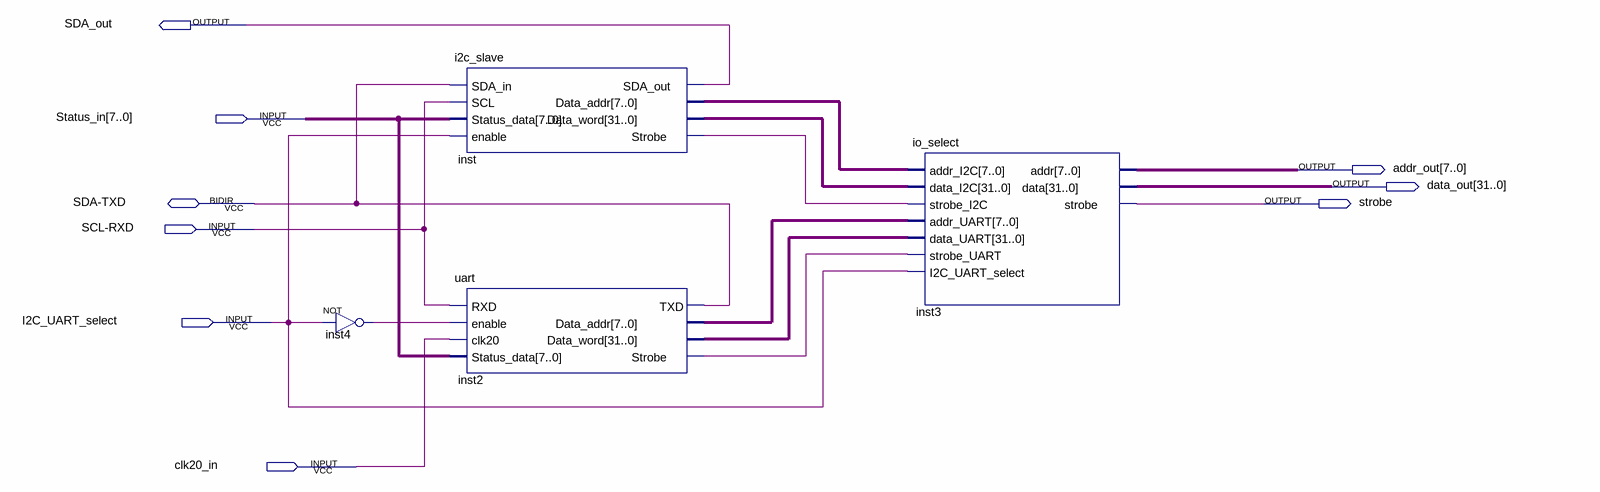
[diagram p0: schematic sheet]
// Quartus schematic control_interface.bdf as structural Verilog: 4 symbols, 9 pins
module control_interface (
  input  [7:0] Status_in,
  input  \SCL-RXD ,
  input  I2C_UART_select,
  input  clk20_in,
  inout  \SDA-TXD ,
  output SDA_out,
  output [7:0] addr_out,
  output [31:0] data_out,
  output strobe
);

  wire inst2_strobe, inst4_out, inst_strobe;
  wire [7:0] inst2_data_addr, inst_data_addr;
  wire [31:0] inst2_data_word, inst_data_word;

  not inst4 (inst4_out, I2C_UART_select);
  i2c_slave inst (
    .SDA_in(\SDA-TXD ), .SCL(\SCL-RXD ), .Status_data(Status_in), .enable(I2C_UART_select),
    .SDA_out(SDA_out), .Data_addr(inst_data_addr), .Data_word(inst_data_word), .Strobe(inst_strobe));
  uart inst2 (
    .RXD(\SCL-RXD ), .enable(inst4_out), .clk20(clk20_in), .Status_data(Status_in),
    .Data_addr(inst2_data_addr), .Data_word(inst2_data_word), .Strobe(inst2_strobe), .TXD(\SDA-TXD ));
  io_select inst3 (
    .addr_I2C(inst_data_addr), .data_I2C(inst_data_word), .strobe_I2C(inst_strobe),
    .addr_UART(inst2_data_addr), .data_UART(inst2_data_word), .strobe_UART(inst2_strobe),
    .I2C_UART_select(I2C_UART_select), .addr(addr_out), .data(data_out), .strobe(strobe));
endmodule
